# Altium project NXP_FRDM_IMX93.PrjPcb (part 3 of 13)

## Sheet E-07 CPU MISC.SchDoc: FRDM-IMX93
size 513 x 386 mm; DrawnBy: FORLINX; Organization: ORGANIZATION; Address1: ADDRESS 1; Address2: ADDRESS 2; Address3: ADDRESS 3; Address4: ADDRESS 4; Revision: -; ENG_APP_DATE: --/--/--; DSN_APP_DATE: --/--/--; CHK_APP_DATE: --/--/--; Classification: Public, Company Internal/Proprietary, Company Confidential,  Company Secret; Page Create Date: March  8, 1995; OrgName: NXP Semiconductor; FIUO: A; OrgAddr1: NO. 192 Liangjing Rd. Pudong New Area, ShangHai; Page Number: 7; PageTitle: CPU MISC; Page Size: C; Page Count: 23; Designer: FORLINX; RevCode: B1; Approver: NXP SE; Doc: SCH-94611 PDF: SPF-94611; DsnPath: T:\FILES\Designs\Single Board Computers\i.MX93-FRDM\Design Files\SCH-94611_B1.DSN; SchematicName: FRDM-i.MX 93 Development Board; PageName: E-07 CPU MISC; PageSize: C; TopSchematic: True
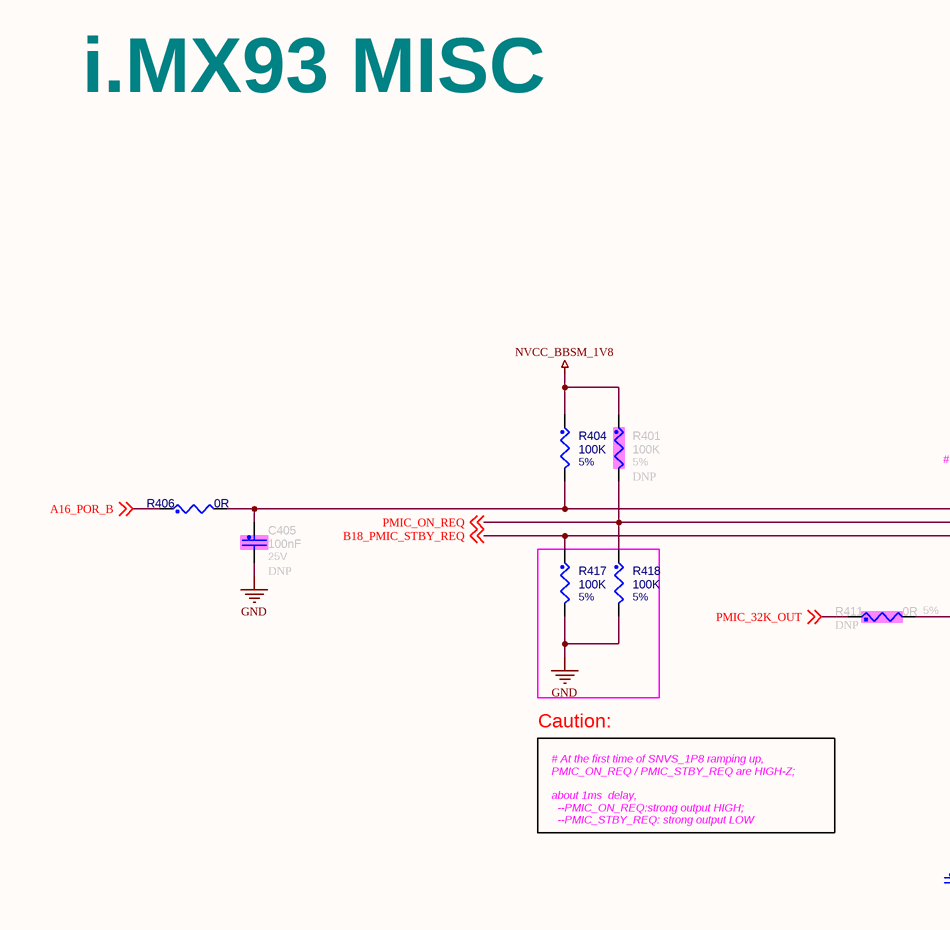
[diagram p13: E-07 CPU MISC.SchDoc, left]
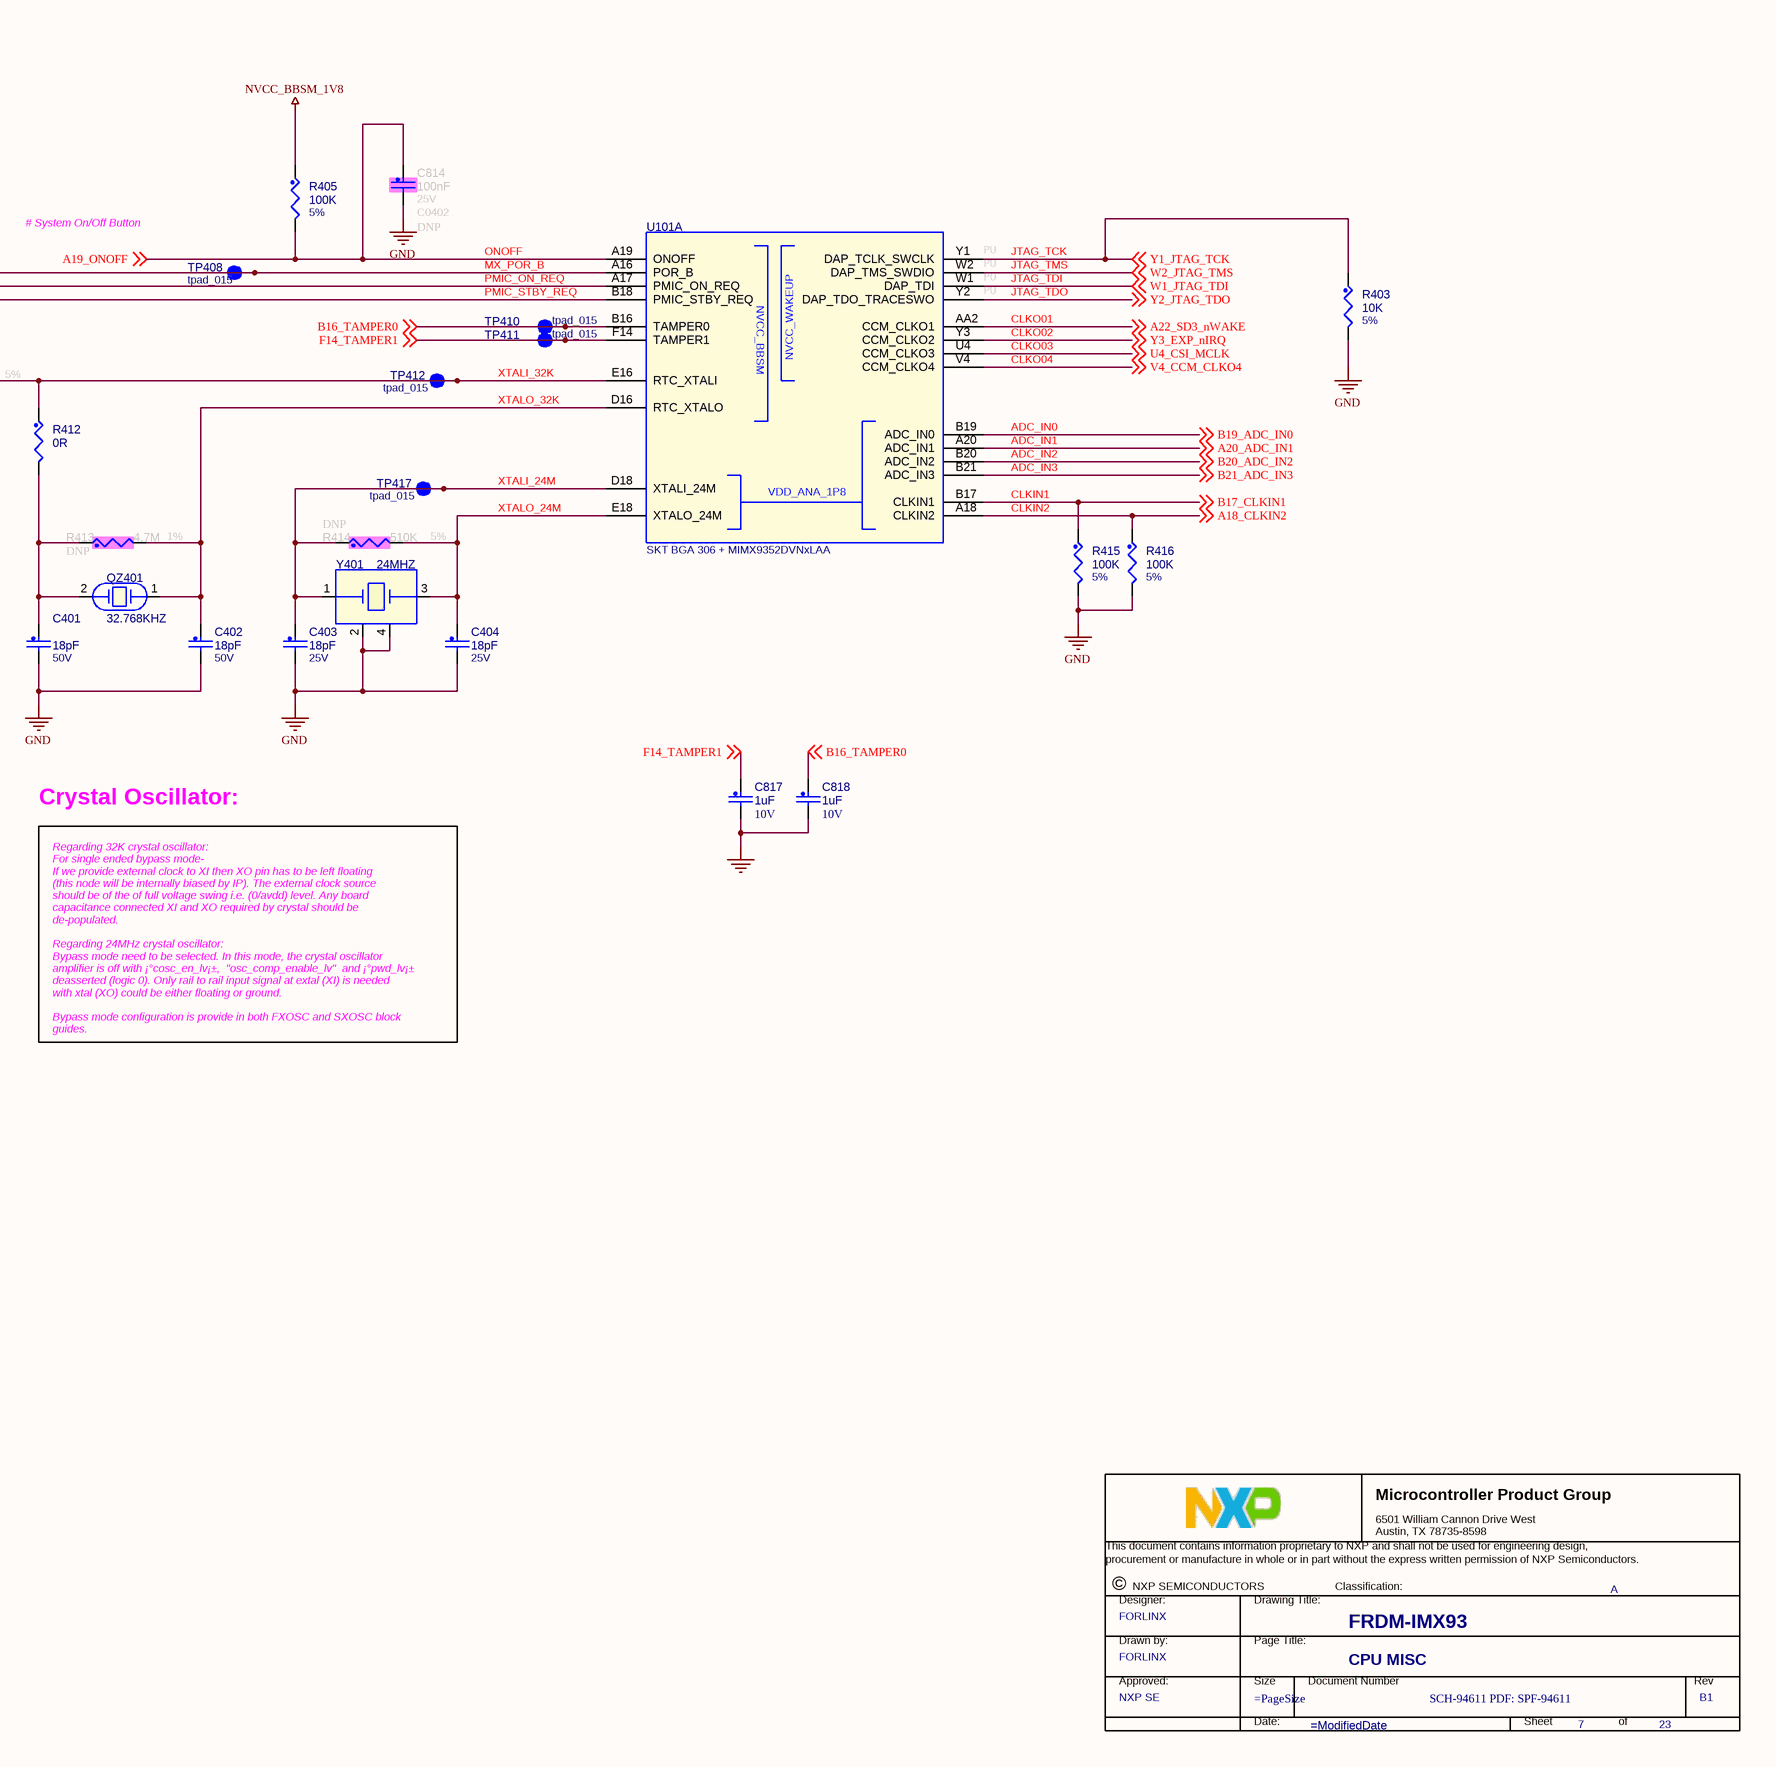
[diagram p14: E-07 CPU MISC.SchDoc, right]

### Parts
(Parts that share a designator on the sheet are numbered #1, #2 ... from top to bottom, then left to right.)
*#7  Title: FRDM-IMX93  RevCode: B1  PageTitle: CPU MISC  Page Number: 7  Page Count: 23  DrawnBy: FORLINX  Doc: SCH-94611 PDF: SPF-94611  Approver: NXP SE  FIUO: A  (graphical)
C401  18pF  VOLTAGE: 50V  [C0201]
C402  18pF  VOLTAGE: 50V  [C0201]
C403  18pF  VOLTAGE: 25V  [C0201]
C404  18pF  VOLTAGE: 25V  [C0201]
C405  100nF  ASSY_OPT: DNP  VOLTAGE: 25V  [C0402]
C814  100nF  ASSY_OPT: DNP  VOLTAGE: 25V  [C0402]
C817  1uF  VOLTAGE: 10V  [C0201]
C818  1uF  VOLTAGE: 10V  [C0201]
QZ401  32.768KHZ  [XTAL2-3P2X1P5-SM]
R401  100K  ASSY_OPT: DNP  Tolerance: 5%  [R0402]
R403  10K  Tolerance: 5%  [R0402]
R404  100K  Tolerance: 5%  [R0402]
R405  100K  Tolerance: 5%  [R0402]
R406  0R  [R0201]
R411  0R  ASSY_OPT: DNP  Tolerance: 5%  [R0201]
R412  0R  [R0201]
R413  4.7M  ASSY_OPT: DNP  Tolerance: 1%  [R0402]
R414  510K  ASSY_OPT: DNP  Tolerance: 5%  [R0402]
R415  100K  Tolerance: 5%  [R0402]
R416  100K  Tolerance: 5%  [R0402]
R417  100K  Tolerance: 5%  [R0402]
R418  100K  Tolerance: 5%  [R0402]
TP408  TPAD_015  [tpad_015]
TP410  TPAD_015  [tpad_015]
TP411  TPAD_015  [tpad_015]
TP412  TPAD_015  [tpad_015]
TP417  TPAD_015  [tpad_015]
U101  SKT BGA 306 + MIMX9352DVNxLAA  [skt_bga306_0p5_sq16p23_elast_nsp]  (part A of 6)
Y401  24MHZ  [xtlosc4_3p2x2p5mm_sm]

### Nets
GND: C401.2 C402.2 C403.2 C404.2 C405.2 C814.2 C817.2 C818.2 R403.2 R415.2 R416.2 R417.2 R418.2 Y401.2 Y401.4
NVCC_BBSM_1V8: R401.1 R404.1 R405.1
A16_POR_B: R406.1 ; off-sheet A16_POR_B
ADC_IN0: U101.B19(ADC_IN0) ; off-sheet B19_ADC_IN0  [also labelled B19_ADC_IN0]
ADC_IN1: U101.A20(ADC_IN1) ; off-sheet A20_ADC_IN1  [also labelled A20_ADC_IN1]
ADC_IN2: U101.B20(ADC_IN2) ; off-sheet B20_ADC_IN2  [also labelled B20_ADC_IN2]
ADC_IN3: U101.B21(ADC_IN3) ; off-sheet B21_ADC_IN3  [also labelled B21_ADC_IN3]
B16_TAMPER0: C818.1 TP410.1(Pin1) U101.B16(TAMPER0) ; off-sheet B16_TAMPER0
CLKIN1: R415.1 U101.B17(CLKIN1) ; off-sheet B17_CLKIN1  [also labelled B17_CLKIN1]
CLKIN2: R416.1 U101.A18(CLKIN2) ; off-sheet A18_CLKIN2  [also labelled A18_CLKIN2]
CLKO01: U101.AA2(CCM_CLKO1) ; off-sheet A22_SD3_nWAKE  [also labelled A22_SD3_nWAKE]
CLKO02: U101.Y3(CCM_CLKO2) ; off-sheet Y3_EXP_nIRQ  [also labelled Y3_EXP_nIRQ]
CLKO03: U101.U4(CCM_CLKO3) ; off-sheet U4_CSI_MCLK  [also labelled U4_CSI_MCLK]
CLKO04: U101.V4(CCM_CLKO4) ; off-sheet V4_CCM_CLKO4  [also labelled V4_CCM_CLKO4]
F14_TAMPER1: C817.1 TP411.1(Pin1) U101.F14(TAMPER1) ; off-sheet F14_TAMPER1
JTAG_TCK: R403.1 U101.Y1(DAP_TCLK_SWCLK) ; off-sheet Y1_JTAG_TCK  [also labelled Y1_JTAG_TCK]
JTAG_TDI: U101.W1(DAP_TDI) ; off-sheet W1_JTAG_TDI  [also labelled W1_JTAG_TDI]
JTAG_TDO: U101.Y2(DAP_TDO_TRACESWO) ; off-sheet Y2_JTAG_TDO  [also labelled Y2_JTAG_TDO]
JTAG_TMS: U101.W2(DAP_TMS_SWDIO) ; off-sheet W2_JTAG_TMS  [also labelled W2_JTAG_TMS]
MX_POR_B: C405.1 R404.2 R406.2 TP408.1(Pin1) U101.A16(POR_B)
ONOFF: C814.1 R405.2 U101.A19(ONOFF) ; off-sheet A19_ONOFF  [also labelled A19_ONOFF]
PMIC_32K_OUT: R411.1 ; off-sheet PMIC_32K_OUT
PMIC_ON_REQ: R401.2 R418.1 U101.A17(PMIC_ON_REQ) ; off-sheet PMIC_ON_REQ
PMIC_STBY_REQ: R417.1 U101.B18(PMIC_STBY_REQ) ; off-sheet B18_PMIC_STBY_REQ  [also labelled B18_PMIC_STBY_REQ]
XTALI_24M: C403.1 R414.1 TP417.1(Pin1) U101.D18(XTALI_24M) Y401.1
XTALI_32K: R411.2 R412.1 TP412.1(Pin1) U101.E16(RTC_XTALI)
XTALO_24M: C404.1 R414.2 U101.E18(XTALO_24M) Y401.3
XTALO_32K: C402.1 QZ401.1 R413.2 U101.D16(RTC_XTALO)
NetC401_1: C401.1 QZ401.2 R412.2 R413.1

### Notes on the sheet
- i.MX93 MISC
- # System On/Off Button
- (near U101) PU
- Caution:
- # At the first time of SNVS_1P8 ramping up,
  PMIC_ON_REQ / PMIC_STBY_REQ are HIGH-Z;
  about 1ms  delay,
  --PMIC_ON_REQ:strong output HIGH;
  --PMIC_STBY_REQ: strong output LOW
- Crystal Oscillator:
- Regarding 32K crystal oscillator:
  For single ended bypass mode-
  If we provide external clock to XI then XO pin has to be left floating
  (this node will be internally biased by IP). The external clock source
  should be of the of full voltage swing i.e. (0/avdd) level. Any board
  capacitance connected XI and XO required by crystal should be
  de-populated.
  Regarding 24MHz crystal oscillator:
  Bypass mode need to be selected. In this mode, the crystal oscillator
  amplifier is off with ¡°cosc_en_lv¡±,  "osc_comp_enable_lv"  and ¡°pwd_lv¡±
  deasserted (logic 0). Only rail to rail input signal at extal (XI) is needed
  with xtal (XO) could be either floating or ground.
  Bypass mode configuration is provide in both FXOSC and SXOSC block
  guides.
- DWG. NO.
- REV.
- SHT.
- REVISION
- DESCRIPTION
- DATE
- APPROVED
- ENG:
- APPROVALS
- quilter.ai <http://quilter.ai>
- DSN:
- CHK:
- REFERENCE DOCUMENTS
- TITLE
- PROJECT
- BOM:
- FAB DWG:
- PCB DWG:
- ASSY DWG:
- SIZE
- FILE NAME
- C
- DWG NO.
- SHEET
- OF
- REV
- (in symbol MIMX9352DVNxLAA, part A) NVCC_BBSM; NVCC_WAKEUP; VDD_ANA_1P8
- (in symbol TitleBlock_MCPG) Microcontroller Product Group; 6501 William Cannon Drive West / Austin, TX 78735-8598; This document contains information proprietary to NXP and shall not be used for engineering design,; procurement or manufacture in whole or in part without the express written permission of NXP Semiconductors.; ©; NXP SEMICONDUCTORS; Classification:; Designer:; Drawing Title:; Drawn by:; Page Title:; Approved:; Size; Document Number; Rev; Date:; Sheet; of

### Library data of the parts
*#7 = TitleBlock_MCPG: Classification: Public, Company Internal/Proprietary, Company Confidential,  Company Secret; OrgAddr1: NO. 192 Liangjing Rd. Pudong New Area, ShangHai; OrgName: NXP Semiconductor; Page Size: =PageSize; Page Create Date: March  8, 1995; Designer: FORLINX; Page Modify Date: =ModifiedDate
C401 = CAP_NP: 0201,18pF,50V,+/-5%,NPO; Part Reference: C401; CLASS: DISCRETE; Tolerance: 5%; MFG_NAME01: FENGHUA; MFG_PN01: 0201CG180J500NT; CAD_APPROVED: Yes; FPLIST: CC0201,CC0201_HD,0201_CC; Value: 18pF; ROHS: Yes; HEIGHT: 0.33MM; Package Size: 0201; Package Type: &#966;180mm Paper taping; PCB Footprint: C0201
C402 = CAP_NP: 0201,18pF,50V,+/-5%,NPO; Part Reference: C402; CLASS: DISCRETE; FPLIST: CC0201,CC0201_HD,0201_CC; CAD_APPROVED: Yes; MFG_PN01: 0201CG180J500NT; MFG_NAME01: FENGHUA; Tolerance: 5%; Value: 18pF; HEIGHT: 0.33MM; ROHS: Yes; Package Size: 0201; Package Type: &#966;180mm Paper taping; PCB Footprint: C0201
C403 = CAP_NP: 0201,18pF,50V,+/-5%,NPO; Part Reference: C403; CLASS: DISCRETE; Tolerance: 5%; MFG_NAME01: FENGHUA; MFG_PN01: 0201CG180J500NT; CAD_APPROVED: Yes; FPLIST: CC0201,CC0201_HD,0201_CC; Value: 18pF; ROHS: Yes; HEIGHT: 0.33MM; PCB Footprint: C0201
C404 = CAP_NP: 0201,18pF,50V,+/-5%,NPO; Part Reference: C404; CLASS: DISCRETE; Tolerance: 5%; MFG_NAME01: FENGHUA; MFG_PN01: 0201CG180J500NT; CAD_APPROVED: Yes; FPLIST: CC0201,CC0201_HD,0201_CC; Value: 18pF; ROHS: Yes; HEIGHT: 0.33MM; PCB Footprint: C0201
C405 = CAP_NP: 0402,100nF,50V,+/-10%,X5R; Part Reference: C405; CLASS: DISCRETE; FPLIST: CC0402_25,CC0402_HD,0402_CC; CAD_APPROVED: Yes; MFG_PN01: 0402X104K500NT; MFG_NAME01: FENGHUA; Tolerance: 10%; Value: 100nF; HEIGHT: 0.55MM; ROHS: Yes; Package Size: 0402; PCB Footprint: C0402
C814 = CAP_NP: 0402,100nF,50V,+/-10%,X5R; Part Reference: C814; CLASS: DISCRETE; Tolerance: 10%; MFG_NAME01: FENGHUA; MFG_PN01: 0402X104K500NT; CAD_APPROVED: Yes; FPLIST: CC0402_25,CC0402_HD,0402_CC; Value: 100nF; Package Size: 0402; ROHS: Yes; HEIGHT: 0.55MM; PCB Footprint: C0402
C817 = CAP_NP: 0201,1uF,10V,+/-20%,X5R; Part Reference: C817; CLASS: DISCRETE; FPLIST: CC0201,CC0201_HD,0201_CC,cc_0201_cir; CAD_APPROVED: Yes; MFG_PN01: CL03A105MP3NSNC; MFG_NAME01: SAMSUNG; Tolerance: 10%; Temp Range: -55¡ãC to 85¡ãC; Value: 1uF; Package Type: SMD/SMT; Package Size: 0201 (0603 Metric); HEIGHT: 0.35MM; ROHS: Yes; PCB Footprint: C0201
C818 = CAP_NP: 0201,1uF,10V,+/-20%,X5R; Part Reference: C818; CLASS: DISCRETE; FPLIST: CC0201,CC0201_HD,0201_CC,cc_0201_cir; CAD_APPROVED: Yes; MFG_PN01: CL03A105MP3NSNC; MFG_NAME01: SAMSUNG; Tolerance: 10%; Temp Range: -55¡ãC to 85¡ãC; Value: 1uF; Package Type: SMD/SMT; Package Size: 0201 (0603 Metric); HEIGHT: 0.35MM; ROHS: Yes; PCB Footprint: C0201
QZ401 = XTAL: Crystal,32.768KHZ,3.2*1.5mm,+/-20ppm,12.5PF,S999-311,-40~85+C; Part Reference: QZ401; CLASS: IC; MFG_NAME01: Dongxin Hengke; MFG_PN01: KK32768g33C; CAD_APPROVED: Yes; Value: 32.768KHZ; ROHS: Yes; HEIGHT: 0.9MM; PCB Footprint: XTAL2-3P2X1P5-SM
R401 = RES: 0402,100K,+/-1%; Part Reference: R401; CLASS: DISCRETE; Temp Range: -55C to +155C; VOLTAGE: 50V; MFG_NAME01: FENGHUA; MFG_PN01: RC-02K1003FT; CAD_APPROVED: Yes; FPLIST: RC0402_25,RC0402_HD,0402_CC; Value: 100K; ROHS: Yes; HEIGHT: 0.40 MM; PCB Footprint: R0402
R403 = RES: 0402,10K,+/-1%; Part Reference: R403; CLASS: DISCRETE; MFG_NAME01: FENGHUA; MFG_PN01: RC-02W1002FT; CAD_APPROVED: Yes; FPLIST: RC0402_25,RC0402_HD,0402_CC; Value: 10K; ROHS: Yes; HEIGHT: 0.4 MM; PCB Footprint: R0402
R404 = RES: 0402,100K,+/-1%; Part Reference: R404; CLASS: DISCRETE; Temp Range: -55C to +155C; VOLTAGE: 50V; MFG_NAME01: FENGHUA; MFG_PN01: RC-02K1003FT; CAD_APPROVED: Yes; FPLIST: RC0402_25,RC0402_HD,0402_CC; Value: 100K; ROHS: Yes; HEIGHT: 0.40 MM; PCB Footprint: R0402
R405 = RES: 0402,100K,+/-1%; Part Reference: R405; CLASS: DISCRETE; FPLIST: RC0402_25,RC0402_HD,0402_CC; CAD_APPROVED: Yes; MFG_PN01: RC-02K1003FT; MFG_NAME01: FENGHUA; VOLTAGE: 50V; Temp Range: -55C to +155C; Value: 100K; HEIGHT: 0.40 MM; ROHS: Yes; PCB Footprint: R0402
R406 = RES: 0201,0Ohm,+/-5%; Part Reference: R406; CLASS: DISCRETE; FPLIST: RC0201,0201_CC,RC0201_X2; CAD_APPROVED: Yes; MFG_PN01: RC-01000JT; MFG_NAME01: FENGHUA; Value: 0R; HEIGHT: 0.30 MM; ROHS: Yes; PCB Footprint: R0201
R411 = RES: 0201,0Ohm,+/-5%; Part Reference: R411; CLASS: DISCRETE; FPLIST: RC0201,0201_CC,RC0201_X2; CAD_APPROVED: Yes; MFG_PN01: RC-01000JT; MFG_NAME01: FENGHUA; Value: 0R; HEIGHT: 0.30 MM; ROHS: Yes; PCB Footprint: R0201
R412 = RES: 0201,0Ohm,+/-5%; Part Reference: R412; CLASS: DISCRETE; FPLIST: RC0201,0201_CC,RC0201_X2; CAD_APPROVED: Yes; MFG_PN01: RC-01000JT; MFG_NAME01: FENGHUA; Value: 0R; HEIGHT: 0.30 MM; ROHS: Yes; PCB Footprint: R0201
R413 = RES: 0402,4.7M,+/-5%; Part Reference: R413; CLASS: DISCRETE; FPLIST: RC0402_25,RC0402_HD,0402_CC; CAD_APPROVED: Yes; VOLTAGE: 50V; Temp Range: -55¡ãC ~ 155¡ãC; MFG_NAME01: FENGHUA; MFG_PN01: RC-02U475JT; Value: 4.7M; HEIGHT: 0.40 MM; ROHS: Yes; PCB Footprint: R0402
R414 = RES: 0402,510K,+/-5%; Part Reference: R414; CLASS: DISCRETE; MFG_NAME01: FENGHUA; MFG_PN01: RC-02K514JT; CAD_APPROVED: Yes; FPLIST: RC0402_25,RC0402_HD,0402_CC; Value: 510K; ROHS: Yes; HEIGHT: 0.4 MM; PCB Footprint: R0402
R415 = RES: 0402,100K,+/-1%; Part Reference: R415; CLASS: DISCRETE; FPLIST: RC0402_25,RC0402_HD,0402_CC; CAD_APPROVED: Yes; MFG_PN01: RC-02K1003FT; MFG_NAME01: FENGHUA; VOLTAGE: 50V; Temp Range: -55C to +155C; Value: 100K; HEIGHT: 0.40 MM; ROHS: Yes; PCB Footprint: R0402
R416 = RES: 0402,100K,+/-1%; Part Reference: R416; CLASS: DISCRETE; FPLIST: RC0402_25,RC0402_HD,0402_CC; CAD_APPROVED: Yes; MFG_PN01: RC-02K1003FT; MFG_NAME01: FENGHUA; VOLTAGE: 50V; Temp Range: -55C to +155C; Value: 100K; HEIGHT: 0.40 MM; ROHS: Yes; PCB Footprint: R0402
R417 = RES: 0402,100K,+/-1%; Part Reference: R417; CLASS: DISCRETE; FPLIST: RC0402_25,RC0402_HD,0402_CC; CAD_APPROVED: Yes; MFG_PN01: RC-02K1003FT; MFG_NAME01: FENGHUA; VOLTAGE: 50V; Temp Range: -55C to +155C; Value: 100K; HEIGHT: 0.40 MM; ROHS: Yes; PCB Footprint: R0402
R418 = RES: 0402,100K,+/-1%; Part Reference: R418; CLASS: DISCRETE; FPLIST: RC0402_25,RC0402_HD,0402_CC; CAD_APPROVED: Yes; MFG_PN01: RC-02K1003FT; MFG_NAME01: FENGHUA; VOLTAGE: 50V; Temp Range: -55C to +155C; Value: 100K; HEIGHT: 0.40 MM; ROHS: Yes; PCB Footprint: R0402
TP408 = TESTLOOP: no part to order; Part Reference: TP408; CLASS: IO; ASSY_OPT: DNP; CAD_APPROVED: Yes; MFG_PN01: NOT A COMPONENT; HEIGHT: 0.1MM; ROHS: Yes; MFG_NAME01: NOT A COMPONENT; PCB Footprint: tpad_015
TP410 = TESTLOOP: no part to order; Part Reference: TP410; CLASS: IO; ASSY_OPT: DNP; MFG_NAME01: NOT A COMPONENT; CAD_APPROVED: Yes; MFG_PN01: NOT A COMPONENT; ROHS: Yes; HEIGHT: 0.1MM; PCB Footprint: tpad_015
TP411 = TESTLOOP: no part to order; Part Reference: TP411; CLASS: IO; ASSY_OPT: DNP; CAD_APPROVED: Yes; MFG_PN01: NOT A COMPONENT; HEIGHT: 0.1MM; ROHS: Yes; MFG_NAME01: NOT A COMPONENT; PCB Footprint: tpad_015
TP412 = TESTLOOP: no part to order; Part Reference: TP412; CLASS: IO; ASSY_OPT: DNP; CAD_APPROVED: Yes; MFG_PN01: NOT A COMPONENT; HEIGHT: 0.1MM; ROHS: Yes; MFG_NAME01: NOT A COMPONENT; PCB Footprint: tpad_015
TP417 = TESTLOOP: no part to order; Part Reference: TP417; CLASS: IO; ASSY_OPT: DNP; MFG_NAME01: NOT A COMPONENT; CAD_APPROVED: Yes; MFG_PN01: NOT A COMPONENT; ROHS: Yes; HEIGHT: 0.1MM; PCB Footprint: tpad_015
U101 = MIMX9352DVNxLAA: MIMX9352CVVXMAB,-40~105+C,11*11mm,0.5mm pitch,FCBGA,A,306pin,1.7GHz; Part Reference: U101; CLASS: IC; MFG_NAME01: NXP SEMICONDUCTORS; CAD_APPROVED: Yes; FPLIST: skt_bga306_0p5_sq16p23_elast,skt_bga306_0p5_sq16p23_elast_nsp; Value: SKT BGA 306 + MIMX9352DVNxLAA; MFG_PN01: MIMX9352DVNxLAA; ROHS: Yes; HEIGHT: 10.03MM; PCB Footprint: skt_bga306_0p5_sq16p23_elast_nsp
Y401 = XTAL_13: Crystal,24MHZ,4P,3.2*2.5mm,+/-20ppm,12pF; Part Reference: Y401; CLASS: IC; MFG_NAME01: Dongxin Hengke; MFG_PN01: SE24000G33D; CAD_APPROVED: Yes; Value: 24MHZ; ROHS: Yes; HEIGHT: 0.60MM; PCB Footprint: xtlosc4_3p2x2p5mm_sm

## Sheet E-08 eMMC.SchDoc: FRDM-IMX93
size 513 x 386 mm; DrawnBy: FORLINX; Organization: ORGANIZATION; Address1: ADDRESS 1; Address2: ADDRESS 2; Address3: ADDRESS 3; Address4: ADDRESS 4; Revision: -; ENG_APP_DATE: --/--/--; DSN_APP_DATE: --/--/--; CHK_APP_DATE: --/--/--; Classification: Public, Company Internal/Proprietary, Company Confidential,  Company Secret; Page Create Date: March  8, 1995; OrgName: NXP Semiconductor; FIUO: A; OrgAddr1: NO. 192 Liangjing Rd. Pudong New Area, ShangHai; Page Number: 8; PageTitle: eMMC; Page Size: C; Comment: TitleBlock_MCPG; Page Count: 23; Designer: FORLINX; RevCode: B1; Approver: NXP SE; Doc: SCH-94611 PDF: SPF-94611; DsnPath: T:\FILES\Designs\Single Board Computers\i.MX93-FRDM\Design Files\SCH-94611_B1.DSN; SchematicName: FRDM-i.MX 93 Development Board; PageName: E-08 eMMC; PageSize: C; TopSchematic: True
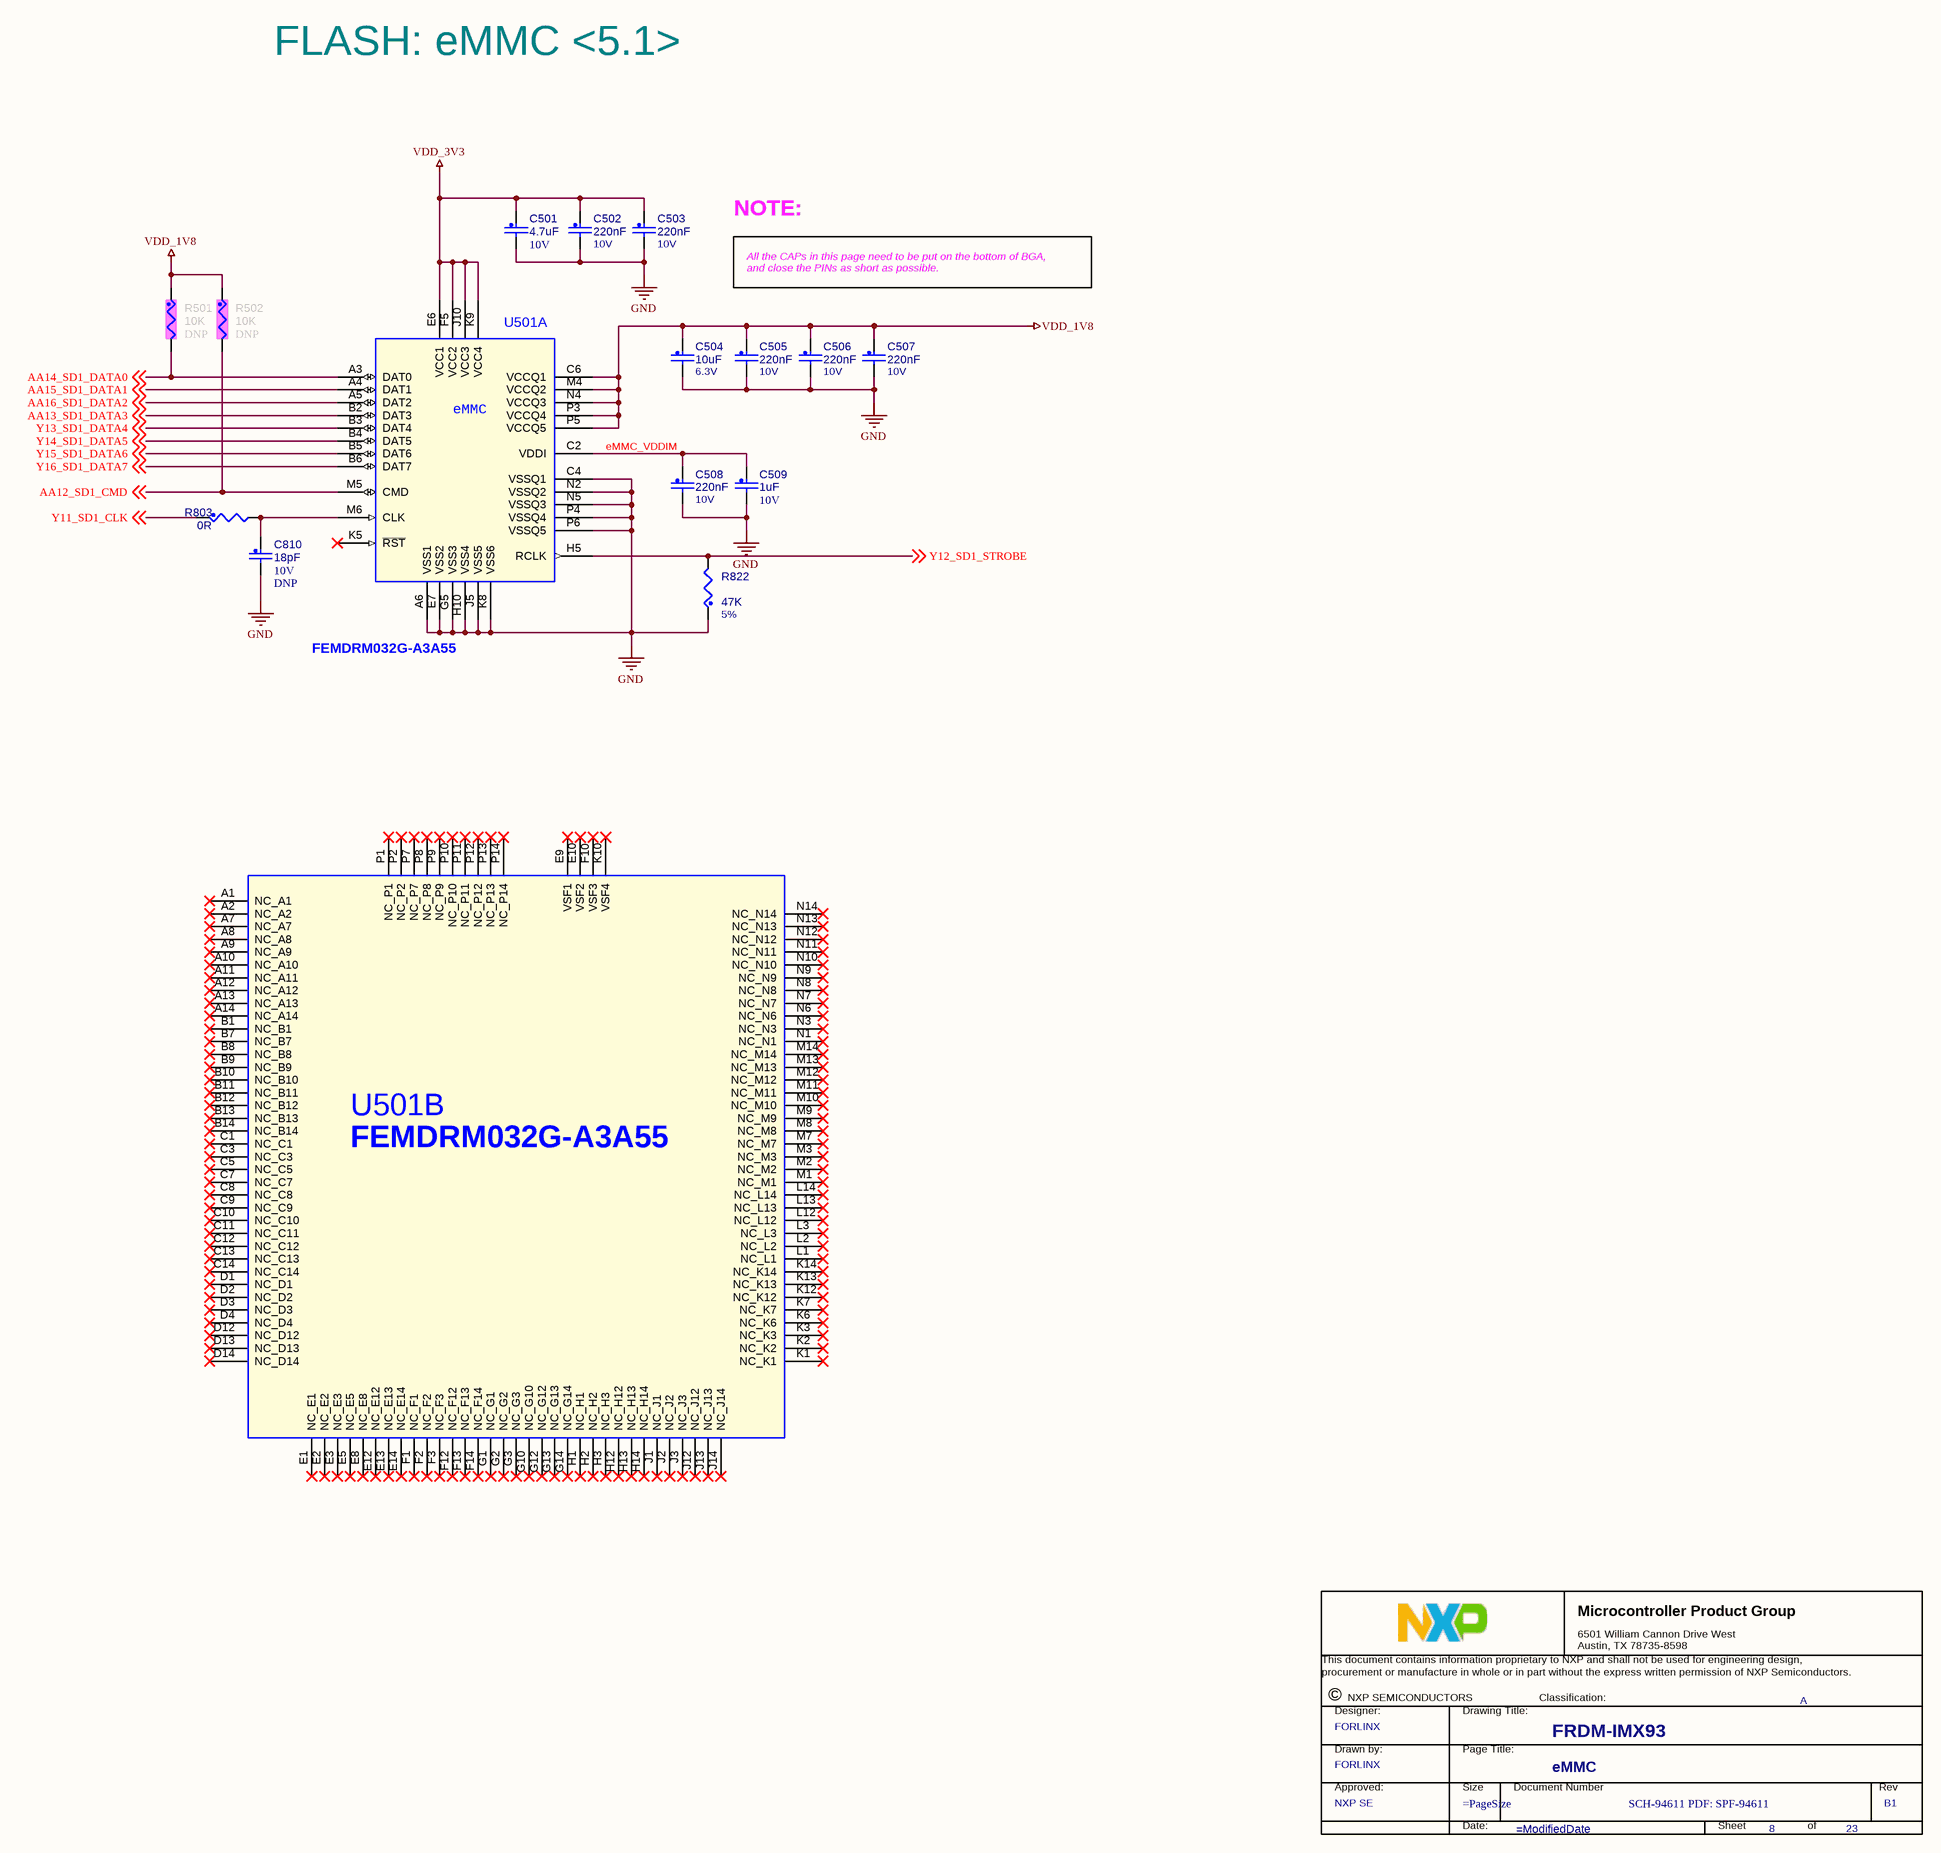
[diagram p15: E-08 eMMC.SchDoc]

### Parts
(Parts that share a designator on the sheet are numbered #1, #2 ... from top to bottom, then left to right.)
*#8  Title: FRDM-IMX93  RevCode: B1  PageTitle: eMMC  Page Number: 8  Page Count: 23  DrawnBy: FORLINX  Doc: SCH-94611 PDF: SPF-94611  Approver: NXP SE  FIUO: A  (hidden comment: TitleBlock_MCPG)  (graphical)
C501  4.7uF  VOLTAGE: 10V  [C0402]
C502  220nF  VOLTAGE: 10V  [C0201]
C503  220nF  VOLTAGE: 10V  [C0201]
C504  10uF  VOLTAGE: 6.3V  [C0402]
C505  220nF  VOLTAGE: 10V  [C0201]
C506  220nF  VOLTAGE: 10V  [C0201]
C507  220nF  VOLTAGE: 10V  [C0201]
C508  220nF  VOLTAGE: 10V  [C0201]
C509  1uF  VOLTAGE: 10V  [C0201]
C810  18pF  ASSY_OPT: DNP  VOLTAGE: 10V  [C0201]
R501  10K  ASSY_OPT: DNP  [R0201]
R502  10K  ASSY_OPT: DNP  [R0201]
R803  0R  [R0201]
R822  47K  Tolerance: 5%  [R0201]
U501  FEMDRM032G-A3A55  [fbga153_0p5_11p5x13]  (parts A,B of 2)

### Nets
GND: C501.2 C502.2 C503.2 C504.2 C505.2 C506.2 C507.2 C508.2 C509.2 C810.2 R822.1 U501.A6(VSS1) U501.C4(VSSQ1) U501.E7(VSS2) U501.G5(VSS3) U501.H10(VSS4) U501.J5(VSS5) U501.K8(VSS6) U501.N2(VSSQ2) U501.N5(VSSQ3) U501.P4(VSSQ4) U501.P6(VSSQ5)
VDD_1V8: C504.1 C505.1 C506.1 C507.1 R501.1 R502.1 U501.C6(VCCQ1) U501.M4(VCCQ2) U501.N4(VCCQ3) U501.P3(VCCQ4) U501.P5(VCCQ5)  [project net LPD4/x_VDD1]
VDD_3V3: C501.1 C502.1 C503.1 U501.E6(VCC1) U501.F5(VCC2) U501.J10(VCC3) U501.K9(VCC4)
AA12_SD1_CMD: R502.2 U501.M5(CMD) ; off-sheet AA12_SD1_CMD  [project net SD1_CMD]
AA13_SD1_DATA3: U501.B2(DAT3) ; off-sheet AA13_SD1_DATA3  [project net SD1_DATA3]
AA14_SD1_DATA0: R501.2 U501.A3(DAT0) ; off-sheet AA14_SD1_DATA0  [project net SD1_DATA0]
AA15_SD1_DATA1: U501.A4(DAT1) ; off-sheet AA15_SD1_DATA1  [project net SD1_DATA1]
AA16_SD1_DATA2: U501.A5(DAT2) ; off-sheet AA16_SD1_DATA2  [project net SD1_DATA2]
eMMC_VDDIM: C508.1 C509.1 U501.C2(VDDI)
Y11_SD1_CLK: R803.1 ; off-sheet Y11_SD1_CLK  [project net SD1_CLK]
Y12_SD1_STROBE: R822.2 U501.H5(RCLK) ; off-sheet Y12_SD1_STROBE  [project net SD1_STROBE]
Y13_SD1_DATA4: U501.B3(DAT4) ; off-sheet Y13_SD1_DATA4  [project net SD1_DATA4]
Y14_SD1_DATA5: U501.B4(DAT5) ; off-sheet Y14_SD1_DATA5  [project net SD1_DATA5]
Y15_SD1_DATA6: U501.B5(DAT6) ; off-sheet Y15_SD1_DATA6  [project net SD1_DATA6]
Y16_SD1_DATA7: U501.B6(DAT7) ; off-sheet Y16_SD1_DATA7  [project net SD1_DATA7]
NetC810_1: C810.1 R803.2 U501.M6(CLK)

Not connected (* = marked no-connect by the designer): U501 A1(NC_A1)* A2(NC_A2)* A7(NC_A7)* A8(NC_A8)* A9(NC_A9)* A10(NC_A10)* A11(NC_A11)* A12(NC_A12)* A13(NC_A13)* A14(NC_A14)* B1(NC_B1)* B7(NC_B7)* B8(NC_B8)* B9(NC_B9)* B10(NC_B10)* B11(NC_B11)* B12(NC_B12)* B13(NC_B13)* B14(NC_B14)* C1(NC_C1)* C3(NC_C3)* C5(NC_C5)* C7(NC_C7)* C8(NC_C8)* C9(NC_C9)* C10(NC_C10)* C11(NC_C11)* C12(NC_C12)* C13(NC_C13)* C14(NC_C14)* D1(NC_D1)* D2(NC_D2)* D3(NC_D3)* D4(NC_D4)* D12(NC_D12)* D13(NC_D13)* D14(NC_D14)* E1(NC_E1)* E2(NC_E2)* E3(NC_E3)* E5(NC_E5)* E8(NC_E8)* E9(VSF1)* E10(VSF2)* E12(NC_E12)* E13(NC_E13)* E14(NC_E14)* F1(NC_F1)* F2(NC_F2)* F3(NC_F3)* F10(VSF3)* F12(NC_F12)* F13(NC_F13)* F14(NC_F14)* G1(NC_G1)* G2(NC_G2)* G3(NC_G3)* G10(NC_G10)* G12(NC_G12)* G13(NC_G13)* G14(NC_G14)* H1(NC_H1)* H2(NC_H2)* H3(NC_H3)* H12(NC_H12)* H13(NC_H13)* H14(NC_H14)* J1(NC_J1)* J2(NC_J2)* J3(NC_J3)* J12(NC_J12)* J13(NC_J13)* J14(NC_J14)* K1(NC_K1)* K2(NC_K2)* K3(NC_K3)* K5(~{RST})* K6(NC_K6)* K7(NC_K7)* K10(VSF4)* K12(NC_K12)* K13(NC_K13)* K14(NC_K14)* L1(NC_L1)* L2(NC_L2)* L3(NC_L3)* L12(NC_L12)* L13(NC_L13)* L14(NC_L14)* M1(NC_M1)* M2(NC_M2)* M3(NC_M3)* M7(NC_M7)* M8(NC_M8)* M9(NC_M9)* M10(NC_M10)* M11(NC_M11)* M12(NC_M12)* M13(NC_M13)* M14(NC_M14)* N1(NC_N1)* N3(NC_N3)* N6(NC_N6)* N7(NC_N7)* N8(NC_N8)* N9(NC_N9)* N10(NC_N10)* N11(NC_N11)* N12(NC_N12)* N13(NC_N13)* N14(NC_N14)* P1(NC_P1)* P2(NC_P2)* P7(NC_P7)* P8(NC_P8)* P9(NC_P9)* P10(NC_P10)* P11(NC_P11)* P12(NC_P12)* P13(NC_P13)* P14(NC_P14)*

### Notes on the sheet
- FLASH: eMMC <5.1>
- NOTE:
- All the CAPs in this page need to be put on the bottom of BGA,
  and close the PINs as short as possible.
- DWG. NO.
- REV.
- SHT.
- REVISION
- DESCRIPTION
- DATE
- APPROVED
- ENG:
- APPROVALS
- quilter.ai <http://quilter.ai>
- DSN:
- CHK:
- REFERENCE DOCUMENTS
- TITLE
- PROJECT
- BOM:
- FAB DWG:
- PCB DWG:
- ASSY DWG:
- SIZE
- FILE NAME
- C
- DWG NO.
- SHEET
- OF
- REV
- (in symbol SDINBDA6_32G_I_VFBGA_153P, part A) eMMC
- (in symbol TitleBlock_MCPG) Microcontroller Product Group; 6501 William Cannon Drive West / Austin, TX 78735-8598; This document contains information proprietary to NXP and shall not be used for engineering design,; procurement or manufacture in whole or in part without the express written permission of NXP Semiconductors.; ©; NXP SEMICONDUCTORS; Classification:; Designer:; Drawing Title:; Drawn by:; Page Title:; Approved:; Size; Document Number; Rev; Date:; Sheet; of

### Library data of the parts
*#8 = TitleBlock_MCPG: Classification: Public, Company Internal/Proprietary, Company Confidential,  Company Secret; OrgName: NXP Semiconductor; OrgAddr1: NO. 192 Liangjing Rd. Pudong New Area, ShangHai; Page Size: =PageSize; Page Create Date: March  8, 1995; Designer: FORLINX; Page Modify Date: =ModifiedDate
C501 = CAP_NP: 0402,4.7uF,10V,+/-10%,X5R; Part Reference: C501; CLASS: DISCRETE; FPLIST: cc0402_tol0p15,cc0402_tol0p15_ov,0402_cc_nsp; CAD_APPROVED: Yes; MFG_PN01: CL05A475KP5NRNC; MFG_NAME01: SAMSUNG; Tolerance: 10%; 3D_Mechanical_Footprint_File: cc0402_tol0p15; Value: 4.7uF; PCB Footprint: C0402; HEIGHT: 0.65MM; ROHS: Yes
C502 = CAP_NP: 0201,220nF,6.3V,+/-20%,X5R; Part Reference: C502; CLASS: DISCRETE; Tolerance: 20%; MFG_NAME01: SAMSUNG; MFG_PN01: CL03A224MQ3NNNC; CAD_APPROVED: Yes; FPLIST: CC0201,CC0201_HD,0201_CC; Value: 220nF; PCB Footprint: C0201; ROHS: Yes; HEIGHT: 0.33MM
C503 = CAP_NP: 0201,220nF,6.3V,+/-20%,X5R; Part Reference: C503; CLASS: DISCRETE; FPLIST: CC0201,CC0201_HD,0201_CC; CAD_APPROVED: Yes; MFG_PN01: CL03A224MQ3NNNC; MFG_NAME01: SAMSUNG; Tolerance: 20%; Value: 220nF; PCB Footprint: C0201; HEIGHT: 0.33MM; ROHS: Yes
C504 = CAP_NP: 0402,10uF,6.3V,+/-20%,X5R; Part Reference: C504; CLASS: DISCRETE; FPLIST: CC0402_25,CC0402_HD,0402_CC; CAD_APPROVED: Yes; MFG_PN01: 0402X106M6R3NT; MFG_NAME01: FENGHUA; Tolerance: 20%; Value: 10uF; PCB Footprint: C0402; HEIGHT: 0.65 MM; ROHS: Yes
C505 = CAP_NP: 0201,220nF,6.3V,+/-20%,X5R; Part Reference: C505; CLASS: DISCRETE; FPLIST: CC0201,CC0201_HD,0201_CC; CAD_APPROVED: Yes; MFG_PN01: CL03A224MQ3NNNC; MFG_NAME01: SAMSUNG; Tolerance: 20%; Value: 220nF; PCB Footprint: C0201; HEIGHT: 0.33MM; ROHS: Yes
C506 = CAP_NP: 0201,220nF,6.3V,+/-20%,X5R; Part Reference: C506; CLASS: DISCRETE; FPLIST: CC0201,CC0201_HD,0201_CC; CAD_APPROVED: Yes; MFG_PN01: CL03A224MQ3NNNC; MFG_NAME01: SAMSUNG; Tolerance: 20%; Value: 220nF; PCB Footprint: C0201; HEIGHT: 0.33MM; ROHS: Yes
C507 = CAP_NP: 0201,220nF,6.3V,+/-20%,X5R; Part Reference: C507; CLASS: DISCRETE; Tolerance: 20%; MFG_NAME01: SAMSUNG; MFG_PN01: CL03A224MQ3NNNC; CAD_APPROVED: Yes; FPLIST: CC0201,CC0201_HD,0201_CC; Value: 220nF; PCB Footprint: C0201; ROHS: Yes; HEIGHT: 0.33MM
C508 = CAP_NP: 0201,220nF,6.3V,+/-20%,X5R; Part Reference: C508; CLASS: DISCRETE; Tolerance: 20%; MFG_NAME01: SAMSUNG; MFG_PN01: CL03A224MQ3NNNC; CAD_APPROVED: Yes; FPLIST: CC0201,CC0201_HD,0201_CC; Value: 220nF; PCB Footprint: C0201; ROHS: Yes; HEIGHT: 0.33MM
C509 = CAP_NP: 0201,1uF,10V,+/-20%,X5R; Part Reference: C509; CLASS: DISCRETE; Temp Range: -55¡ãC to 85¡ãC; FPLIST: CC0201,CC0201_HD,0201_CC,cc_0201_cir; CAD_APPROVED: Yes; MFG_PN01: CL03A105MP3NSNC; MFG_NAME01: SAMSUNG; Tolerance: 10%; Value: 1uF; PCB Footprint: C0201; HEIGHT: 0.35MM; ROHS: Yes; Package Size: 0201 (0603 Metric); Package Type: SMD/SMT
C810 = CAP_NP: 0201,18pF,50V,+/-5%,NPO; Part Reference: C810; CLASS: DISCRETE; Temp Range: -55¡ãC to 85¡ãC; FPLIST: CC0201,CC0201_HD,0201_CC,cc_0201_cir; CAD_APPROVED: Yes; MFG_PN01: 0201CG180J500NT; MFG_NAME01: FENGHUA; Tolerance: 10%; Value: 18pF; PCB Footprint: C0201; HEIGHT: 0.35MM; ROHS: Yes; Package Size: 0201 (0603 Metric); Package Type: SMD/SMT
R501 = RES: 0201,10K,+/-5%; Part Reference: R501; CLASS: DISCRETE; Tolerance: 5%; MFG_NAME01: FENGHUA; MFG_PN01: RC-01W103JT; CAD_APPROVED: Yes; FPLIST: RC0402_25,RC0402_HD,0402_CC; Value: 10K; PCB Footprint: R0201; ROHS: Yes; HEIGHT: 0.4 MM
R502 = RES: 0201,10K,+/-5%; Part Reference: R502; CLASS: DISCRETE; FPLIST: RC0402_25,RC0402_HD,0402_CC; CAD_APPROVED: Yes; MFG_PN01: RC-01W103JT; MFG_NAME01: FENGHUA; Tolerance: 5%; Value: 10K; PCB Footprint: R0201; HEIGHT: 0.4 MM; ROHS: Yes
R803 = RES: 0201,0Ohm,+/-5%; Part Reference: R803; CLASS: DISCRETE; FPLIST: RC0402_25,RC0402_HD,0402_CC; CAD_APPROVED: Yes; MFG_PN01: RC-01000JT; MFG_NAME01: FENGHUA; Tolerance: 5%; Value: 0R; PCB Footprint: R0201; HEIGHT: 0.4 MM; ROHS: Yes
R822 = RES: 0201,47K,5%; Part Reference: R822; CLASS: DISCRETE; FPLIST: RC0201,0201_CC; CAD_APPROVED: Yes; Temp_Range: -55¡ãC ~ 125¡ãC; MFG_PN01: RC-01W473JT; MFG_NAME01: FENGHUA; VOLTAGE: 25V; Value: 47K; PCB Footprint: R0201; HEIGHT: 0.26MM; ROHS: Yes; Temp Range: -55¡ãC ~ 125¡ãC
U501 = SDINBDA6_32G_I_VFBGA_153P: FEMDRM032G-A3A55,153FBGA,eMMC5.1,32GB,-25~85+C; Part Reference: U501; CLASS: IC; CAD_APPROVED: Yes; Temp Range: -25¡ãC to 85¡ãC; MFG_NAME01: FORESEE; Value: FEMDRM032G-A3A55; HEIGHT: 1MM; ROHS: Yes; MFG_PN01: FEMDRM032G-A3A55; PCB Footprint: fbga153_0p5_11p5x13

## Sheet E-09 BOOT_CFG.SchDoc: FRDM-IMX93
size 513 x 386 mm; DrawnBy: FORLINX; Organization: ORGANIZATION; Address1: ADDRESS 1; Address2: ADDRESS 2; Address3: ADDRESS 3; Address4: ADDRESS 4; Revision: -; ENG_APP_DATE: --/--/--; DSN_APP_DATE: --/--/--; CHK_APP_DATE: --/--/--; Classification: Public, Company Internal/Proprietary, Company Confidential,  Company Secret; Page Create Date: March  8, 1995; OrgName: NXP Semiconductor; FIUO: A; OrgAddr1: NO. 192 Liangjing Rd. Pudong New Area, ShangHai; Page Number: 9; PageTitle: BOOT CFG; Page Size: C; Page Count: 23; Designer: FORLINX; RevCode: B1; Approver: NXP SE; Doc: SCH-94611 PDF: SPF-94611; DsnPath: T:\FILES\Designs\Single Board Computers\i.MX93-FRDM\Design Files\SCH-94611_B1.DSN; SchematicName: FRDM-i.MX 93 Development Board; PageName: E-09 BOOT_CFG; PageSize: C; TopSchematic: True
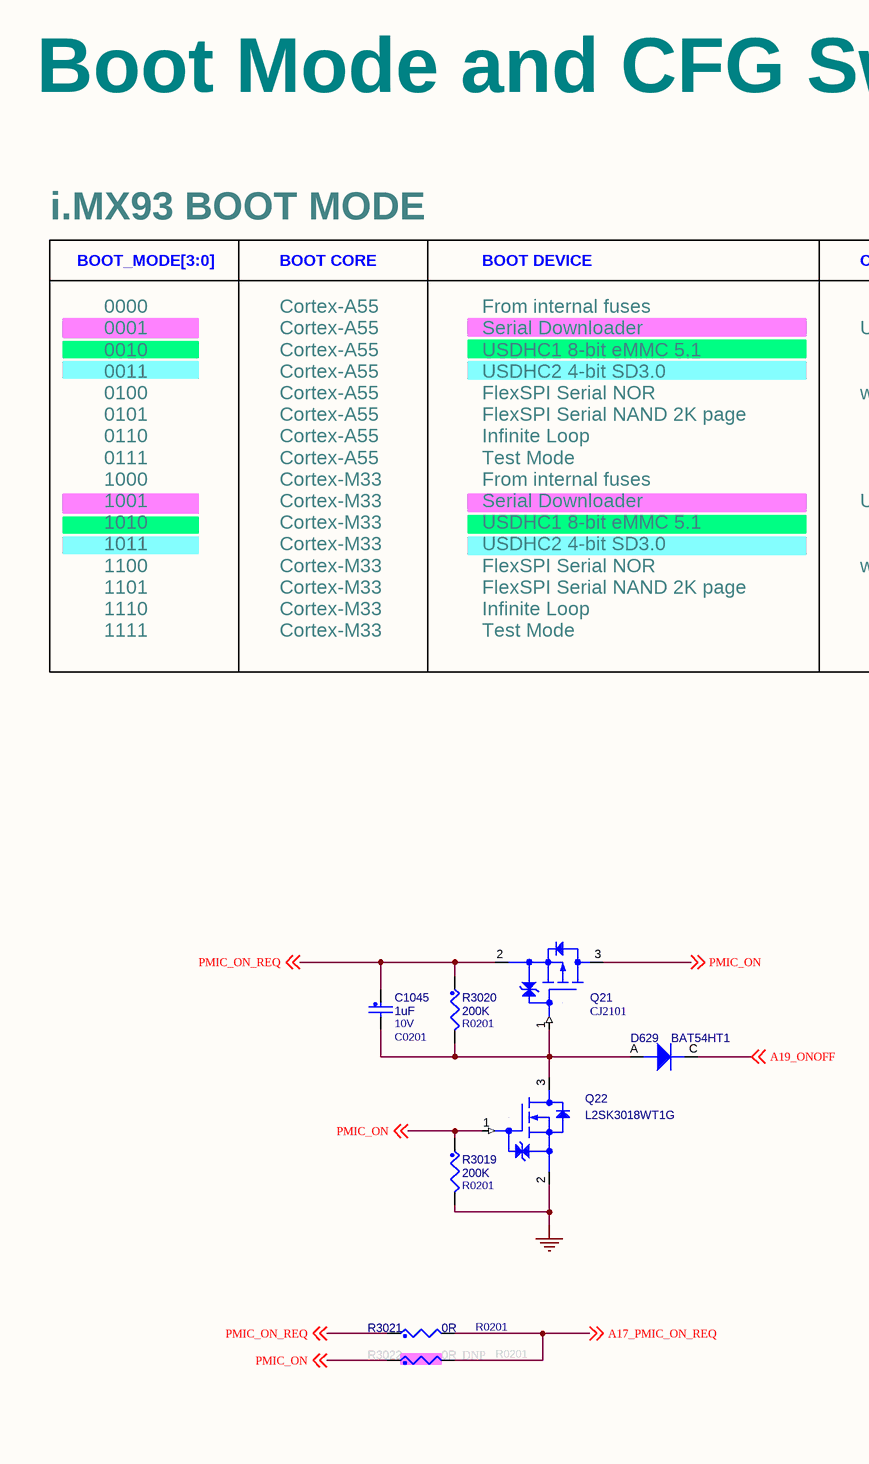
[diagram p16: E-09 BOOT_CFG.SchDoc, left]
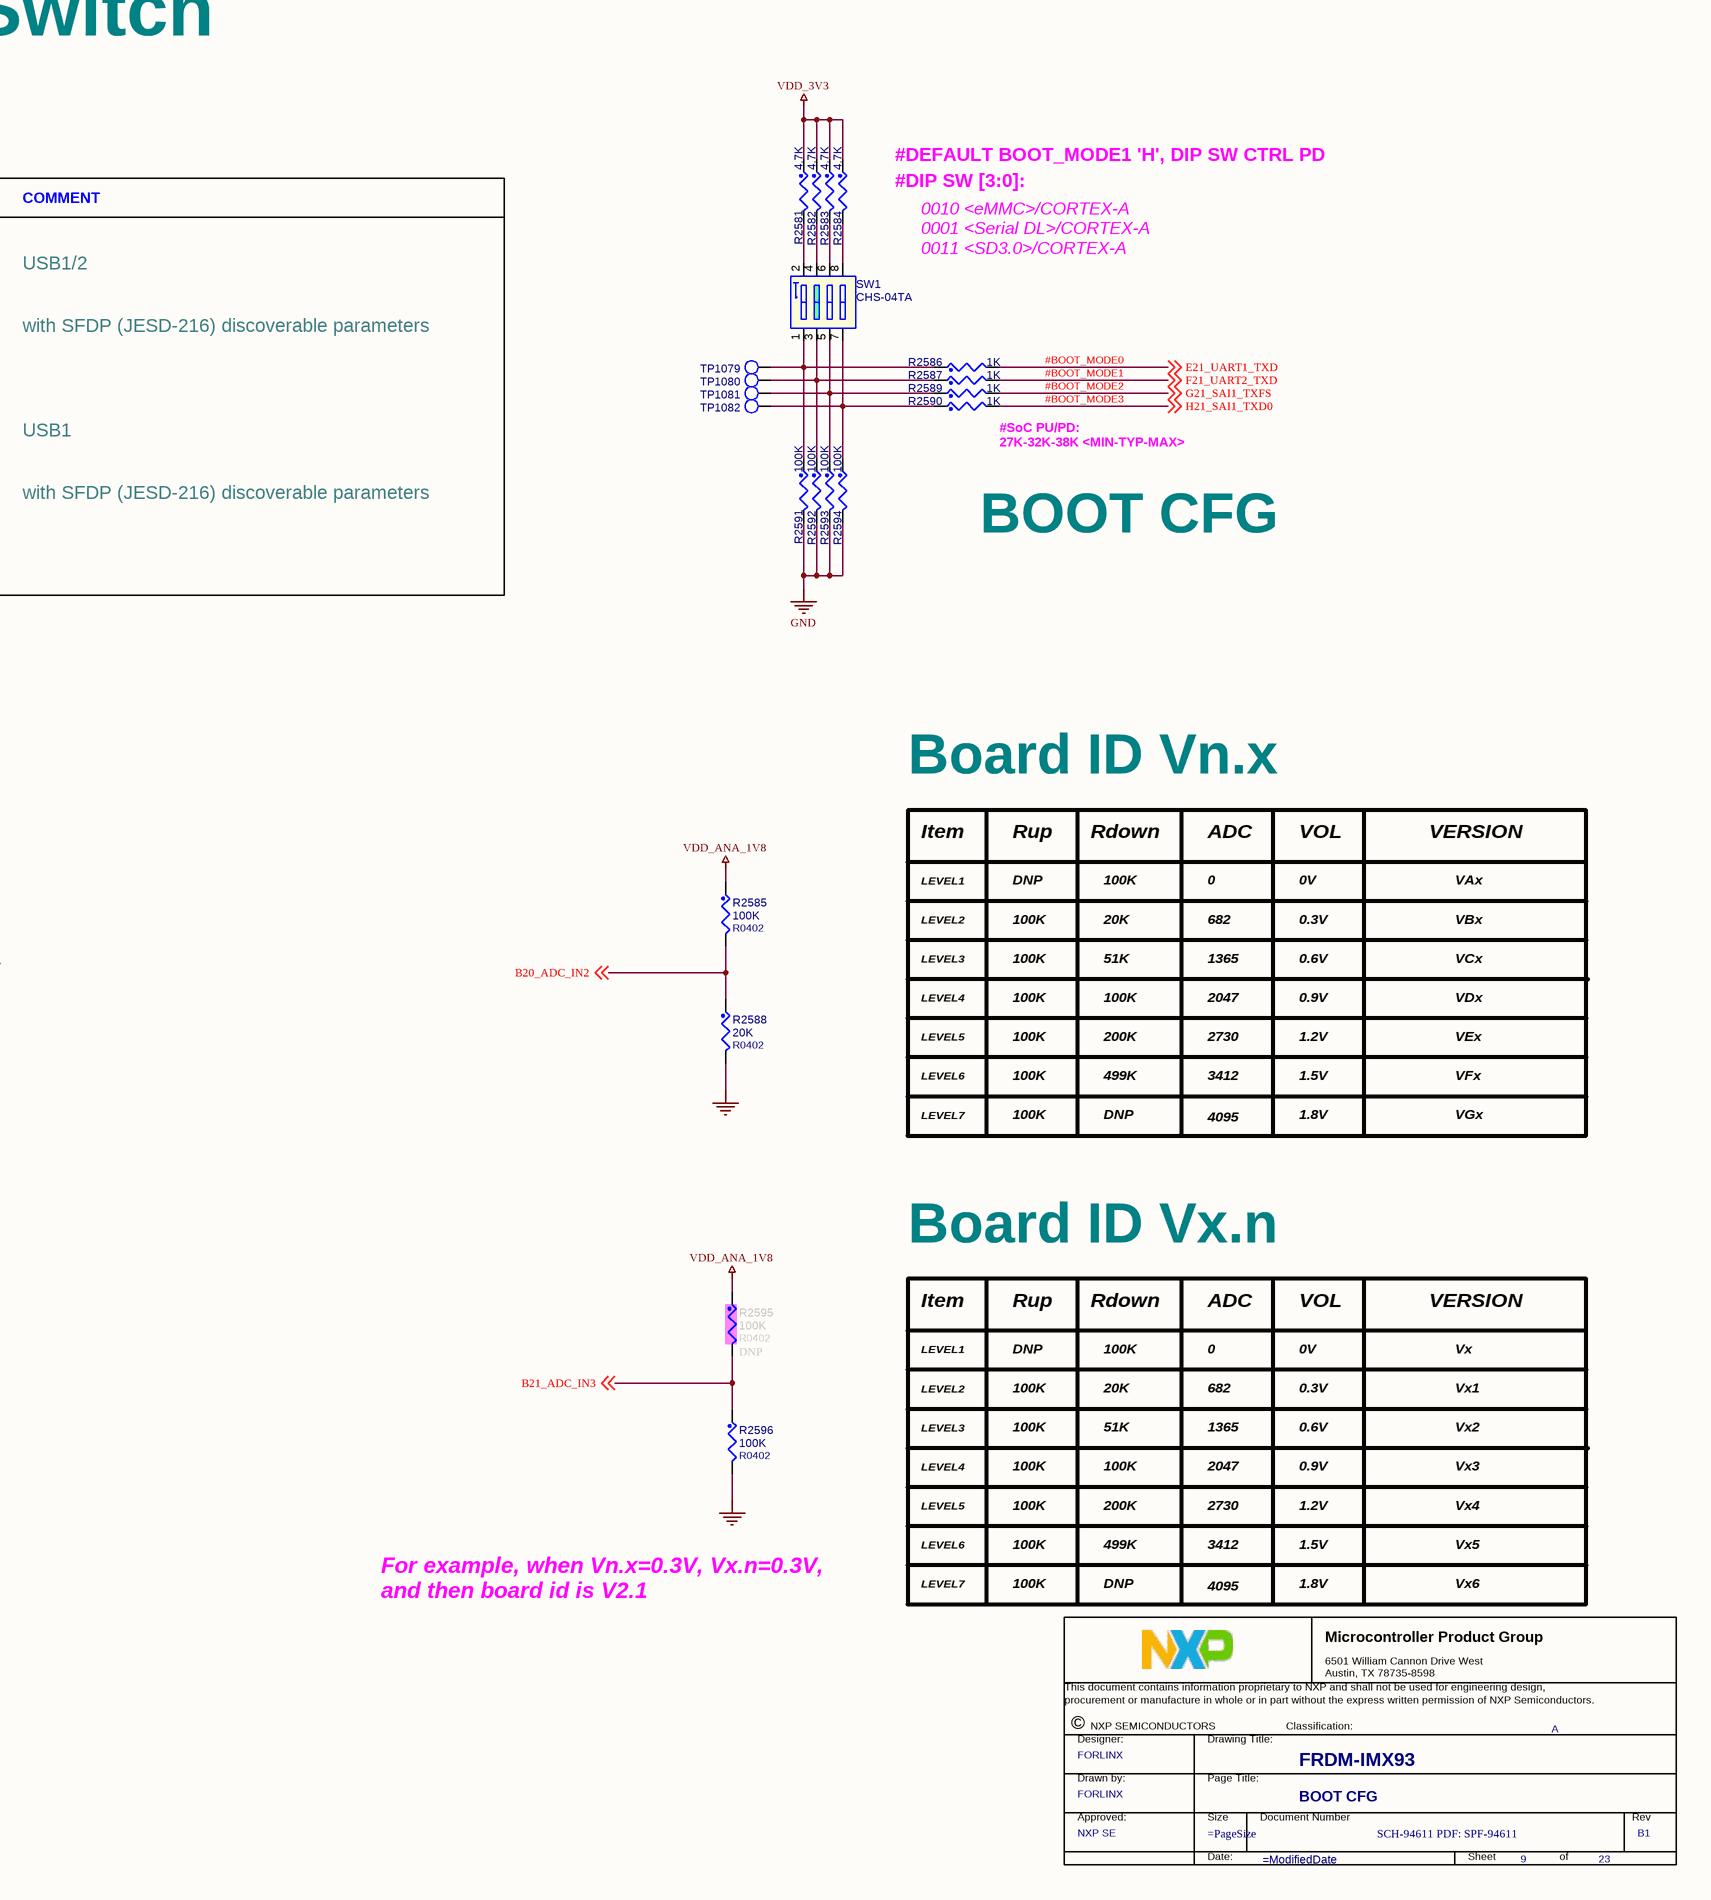
[diagram p17: E-09 BOOT_CFG.SchDoc, right]

### Parts
(Parts that share a designator on the sheet are numbered #1, #2 ... from top to bottom, then left to right.)
*#9  Title: FRDM-IMX93  RevCode: B1  PageTitle: BOOT CFG  Page Number: 9  Page Count: 23  DrawnBy: FORLINX  Doc: SCH-94611 PDF: SPF-94611  Approver: NXP SE  FIUO: A  (graphical)
C1045  1uF  VOLTAGE: 10V  [C0201]
D629  BAT54HT1  [SOD323]
Q21  CJ2101  [sc70_3]
Q22  L2SK3018WT1G  [sc70_3]
R2581  4.7K  [R0201]
R2582  4.7K  [R0201]
R2583  4.7K  [R0201]
R2584  4.7K  [R0201]
R2585  100K  [R0402]
R2586  1K  [R0201]
R2587  1K  [R0201]
R2588  20K  [R0402]
R2589  1K  [R0201]
R2590  1K  [R0201]
R2591  100K  [R0201]
R2592  100K  [R0201]
R2593  100K  [R0201]
R2594  100K  [R0201]
R2595  100K  ASSY_OPT: DNP  [R0402]
R2596  100K  [R0402]
R3019  200K  [R0201]
R3020  200K  [R0201]
R3021  0R  [R0201]
R3022  0R  ASSY_OPT: DNP  [R0201]
SW1  CHS-04TA  [sw_chs_04_a]
TP1079  TPAD_020  [tpad_020]  (value not drawn)
TP1080  TPAD_020  [tpad_020]  (value not drawn)
TP1081  TPAD_020  [tpad_020]  (value not drawn)
TP1082  TPAD_020  [tpad_020]  (value not drawn)

### Nets
GND: Q22.2(SOURCE) R2588.2 R2591.2 R2592.2 R2593.2 R2594.2 R2596.2 R3019.2
VDD_3V3: R2581.1 R2582.1 R2583.1 R2584.1
VDD_ANA_1V8: R2585.1 R2595.1
#BOOT_MODE0: R2586.2 ; off-sheet E21_UART1_TXD  [also labelled E21_UART1_TXD]
#BOOT_MODE1: R2587.2 ; off-sheet F21_UART2_TXD  [also labelled F21_UART2_TXD]
#BOOT_MODE2: R2589.2 ; off-sheet G21_SAI1_TXFS  [also labelled G21_SAI1_TXFS]
#BOOT_MODE3: R2590.2 ; off-sheet H21_SAI1_TXD0  [also labelled H21_SAI1_TXD0]
A17_PMIC_ON_REQ: R3021.2 R3022.2 ; off-sheet A17_PMIC_ON_REQ
A19_ONOFF: D629.C(CATHODE) ; off-sheet A19_ONOFF  [project net ONOFF]
B20_ADC_IN2: R2585.2 R2588.1 ; off-sheet B20_ADC_IN2  [project net ADC_IN2]
B21_ADC_IN3: R2595.2 R2596.1 ; off-sheet B21_ADC_IN3  [project net ADC_IN3]
PMIC_ON: Q21.3(DRAIN) Q22.1(GATE) R3019.1 R3022.1 ; off-sheet PMIC_ON
PMIC_ON_REQ: C1045.1 Q21.2(SOURCE) R3020.1 R3021.1 ; off-sheet PMIC_ON_REQ
NetC1045_2: C1045.2 D629.A(ANODE) Q21.1(GATE) Q22.3(DRAIN) R3020.2
NetR2581_2: R2581.2 SW1.2
NetR2582_2: R2582.2 SW1.4
NetR2583_2: R2583.2 SW1.6
NetR2584_2: R2584.2 SW1.8
NetR2586_1: R2586.1 R2591.1 SW1.1 TP1079.1(TP)
NetR2587_1: R2587.1 R2592.1 SW1.3 TP1080.1(TP)
NetR2589_1: R2589.1 R2593.1 SW1.5 TP1081.1(TP)
NetR2590_1: R2590.1 R2594.1 SW1.7 TP1082.1(TP)

### Notes on the sheet
- Boot Mode and CFG Switch
- i.MX93 BOOT MODE
- BOOT_MODE[3:0]
- BOOT CORE
- BOOT DEVICE
- COMMENT
- #DEFAULT BOOT_MODE1 'H', DIP SW CTRL PD
- #DIP SW [3:0]:
- 0010 <eMMC>/CORTEX-A
  0001 <Serial DL>/CORTEX-A
  0011 <SD3.0>/CORTEX-A
- #SoC PU/PD:
  27K-32K-38K <MIN-TYP-MAX>
- 0000
  0001
  0010
  0011
  0100
  0101
  0110
  0111
  1000
  1001
  1010
  1011
  1100
  1101
  1110
  1111
- Cortex-A55
  Cortex-A55
  Cortex-A55
  Cortex-A55
  Cortex-A55
  Cortex-A55
  Cortex-A55
  Cortex-A55
  Cortex-M33
  Cortex-M33
  Cortex-M33
  Cortex-M33
  Cortex-M33
  Cortex-M33
  Cortex-M33
  Cortex-M33
- From internal fuses
  Serial Downloader
  USDHC1 8-bit eMMC 5.1
  USDHC2 4-bit SD3.0
  FlexSPI Serial NOR
  FlexSPI Serial NAND 2K page
  Infinite Loop
  Test Mode
  From internal fuses
  Serial Downloader
  USDHC1 8-bit eMMC 5.1
  USDHC2 4-bit SD3.0
  FlexSPI Serial NOR
  FlexSPI Serial NAND 2K page
  Infinite Loop
  Test Mode
- USB1/2
  with SFDP (JESD-216) discoverable parameters
  USB1
  with SFDP (JESD-216) discoverable parameters
- BOOT CFG
- Board ID Vn.x
- Item
- Rup
- Rdown
- ADC
- VOL
- VERSION
- LEVEL2
- LEVEL1
- 100K
- DNP
- 20K
- 0
- 682
- 0V
- 0.3V
- VAx
- VBx
- LEVEL3
- 51K
- 1365
- 0.6V
- VCx
- LEVEL5
- LEVEL4
- 200K
- 2047
- 2730
- 0.9V
- 1.2V
- VEx
- VDx
- LEVEL7
- LEVEL6
- 499K
- 3412
- 4095
- 1.8V
- 1.5V
- VFx
- VGx
- Board ID Vx.n
- Vx
- Vx2
- Vx1
- Vx4
- Vx3
- Vx5
- For example, when Vn.x=0.3V, Vx.n=0.3V,
  and then board id is V2.1
- (near *#9) 100K
- (near *#9) DNP
- Vx6
- DWG. NO.
- REV.
- SHT.
- REVISION
- DESCRIPTION
- DATE
- APPROVED
- ENG:
- APPROVALS
- quilter.ai <http://quilter.ai>
- DSN:
- CHK:
- REFERENCE DOCUMENTS
- TITLE
- PROJECT
- BOM:
- FAB DWG:
- PCB DWG:
- ASSY DWG:
- SIZE
- FILE NAME
- C
- DWG NO.
- SHEET
- OF
- REV
- (in symbol TitleBlock_MCPG) Microcontroller Product Group; 6501 William Cannon Drive West / Austin, TX 78735-8598; This document contains information proprietary to NXP and shall not be used for engineering design,; procurement or manufacture in whole or in part without the express written permission of NXP Semiconductors.; ©; NXP SEMICONDUCTORS; Classification:; Designer:; Drawing Title:; Drawn by:; Page Title:; Approved:; Size; Document Number; Rev; Date:; Sheet; of

### Library data of the parts
*#9 = TitleBlock_MCPG: as *#7 on sheet E-07 CPU MISC; Page Size: =PageSize; Page Create Date: March  8, 1995; Designer: FORLINX; Page Modify Date: =ModifiedDate
C1045 = CAP_NP: 0201,1uF,10V,+/-20%,X5R; Part Reference: C1045; CLASS: DISCRETE; Tolerance: 20%; MFG_NAME01: SAMSUNG; MFG_PN01: CL03A105MP3NSNC; CAD_APPROVED: Yes; FPLIST: CC0201,CC0201_HD,0201_CC,0201_CC_012SM_NSP; Value: 1uF; PCB Footprint: C0201; ROHS: Yes; HEIGHT: 0.35MM; Package Size: 0201; Package Type: 7¡± reel
D629 = DIODE: BAT54HT1G,SOD323; Part Reference: D629; CLASS: IC; MFG_NAME01: JSCJ; CAD_APPROVED: Yes; Value: BAT54HT1; PCB Footprint: SOD323; MFG_PN01: BAT54HT1G; HEIGHT: 1.15MM
Q21 = CJ2101: CJ2101,SOT-323,PMOS; Part Reference: Q21; MFG_NAME01: JSCJ; Value: CJ2101; PCB Footprint: sc70_3; MFG_PN01: CJ2101
Q22 = NX3008NBKW_SOT323: Part Reference: Q22; CLASS: IC; MFG_NAME01: LRC; CAD_APPROVED: Yes; Value: L2SK3018WT1G; PCB Footprint: sc70_3; MFG_PN01: L2SK3018WT1G; ROHS: Yes; HEIGHT: 1.1MM
R2581 = RES: 0201,4.7K,+/-1%; Part Reference: R2581; CLASS: DISCRETE; FPLIST: RC0402_25,RC0402_HD,0402_CC,RC0402_X2; Tolerance: 5%; CAD_APPROVED: Yes; MFG_NAME01: FENGHUA; MFG_PN01: RC-01W4701FT; Value: 4.7K; PCB Footprint: R0201; HEIGHT: 0.41mm; ROHS: Yes
R2582 = RES: 0201,4.7K,+/-1%; Part Reference: R2582; CLASS: DISCRETE; MFG_PN01: RC-01W4701FT; MFG_NAME01: FENGHUA; CAD_APPROVED: Yes; Tolerance: 5%; FPLIST: RC0402_25,RC0402_HD,0402_CC,RC0402_X2; Value: 4.7K; PCB Footprint: R0201; ROHS: Yes; HEIGHT: 0.41mm
R2583 = RES: 0201,4.7K,+/-1%; Part Reference: R2583; CLASS: DISCRETE; FPLIST: RC0402_25,RC0402_HD,0402_CC,RC0402_X2; Tolerance: 5%; CAD_APPROVED: Yes; MFG_NAME01: FENGHUA; MFG_PN01: RC-01W4701FT; Value: 4.7K; PCB Footprint: R0201; HEIGHT: 0.41mm; ROHS: Yes
R2584 = RES: 0201,4.7K,+/-1%; Part Reference: R2584; CLASS: DISCRETE; FPLIST: RC0402_25,RC0402_HD,0402_CC,RC0402_X2; Tolerance: 5%; CAD_APPROVED: Yes; MFG_NAME01: FENGHUA; MFG_PN01: RC-01W4701FT; Value: 4.7K; PCB Footprint: R0201; HEIGHT: 0.41mm; ROHS: Yes
R2585 = RES: 0402,100K,+/-1%; Part Reference: R2585; CLASS: DISCRETE; FPLIST: RC0402_25,RC0402_HD,RC0402_X2,0402_CC,CAPC0402_L; CAD_APPROVED: Yes; MFG_PN01: RC-02K1003FT; MFG_NAME01: FENGHUA; Tolerance: 5%; RATING: 1/16W; Value: 100K; PCB Footprint: R0402; HEIGHT: 0.41mm; ROHS: Yes
R2586 = RES: 0201,1K,+/-1%; Part Reference: R2586; CLASS: DISCRETE; FPLIST: RC0402_25,RC0402_HD,RC0402_X2,0402_CC,CAPC0402_L; CAD_APPROVED: Yes; MFG_PN01: RC-01W1001FT; MFG_NAME01: FENGHUA; Tolerance: 5%; RATING: 1/16W; Value: 1K; PCB Footprint: R0201; HEIGHT: 0.41mm; ROHS: Yes
R2587 = RES: 0201,1K,+/-1%; Part Reference: R2587; CLASS: DISCRETE; FPLIST: RC0402_25,RC0402_HD,RC0402_X2,0402_CC,CAPC0402_L; CAD_APPROVED: Yes; MFG_PN01: RC-01W1001FT; MFG_NAME01: FENGHUA; Tolerance: 5%; RATING: 1/16W; Value: 1K; PCB Footprint: R0201; HEIGHT: 0.41mm; ROHS: Yes
R2588 = RES: 0402,20K,+/-1%; Part Reference: R2588; CLASS: DISCRETE; FPLIST: RC0402_25,RC0402_HD,RC0402_X2,0402_CC,CAPC0402_L; CAD_APPROVED: Yes; MFG_PN01: RC-02K2002FT; MFG_NAME01: FENGHUA; Tolerance: 5%; RATING: 1/16W; Value: 20K; PCB Footprint: R0402; HEIGHT: 0.41mm; ROHS: Yes
R2589 = RES: 0201,1K,+/-1%; Part Reference: R2589; CLASS: DISCRETE; FPLIST: RC0402_25,RC0402_HD,RC0402_X2,0402_CC,CAPC0402_L; CAD_APPROVED: Yes; MFG_PN01: RC-01W1001FT; MFG_NAME01: FENGHUA; Tolerance: 5%; RATING: 1/16W; Value: 1K; PCB Footprint: R0201; HEIGHT: 0.41mm; ROHS: Yes
R2590 = RES: 0201,1K,+/-1%; Part Reference: R2590; CLASS: DISCRETE; FPLIST: RC0402_25,RC0402_HD,RC0402_X2,0402_CC,CAPC0402_L; CAD_APPROVED: Yes; MFG_PN01: RC-01W1001FT; MFG_NAME01: FENGHUA; Tolerance: 5%; RATING: 1/16W; Value: 1K; PCB Footprint: R0201; HEIGHT: 0.41mm; ROHS: Yes
R2591 = RES: 0201,100K,+/-1%; Part Reference: R2591; CLASS: DISCRETE; RATING: 1/16W; Tolerance: 5%; MFG_NAME01: FENGHUA; MFG_PN01: RC-01W1003FT; CAD_APPROVED: Yes; FPLIST: RC0402_25,RC0402_HD,RC0402_X2,0402_CC,CAPC0402_L; Value: 100K; PCB Footprint: R0201; ROHS: Yes; HEIGHT: 0.41mm
R2592 = RES: 0201,100K,+/-1%; Part Reference: R2592; CLASS: DISCRETE; VOLTAGE: 50V; Tolerance: 5%; MFG_PN01: RC-01W1003FT; MFG_NAME01: FENGHUA; Temp Range: -55C to +155C; CAD_APPROVED: Yes; FPLIST: RC0402_25,RC0402_HD,0402_CC; Value: 100K; PCB Footprint: R0201; ROHS: Yes; HEIGHT: 0.40 MM
R2593 = RES: 0201,100K,+/-1%; Part Reference: R2593; CLASS: DISCRETE; FPLIST: RC0402_25,RC0402_HD,0402_CC; CAD_APPROVED: Yes; Temp Range: -55C to +155C; MFG_NAME01: FENGHUA; MFG_PN01: RC-01W1003FT; Tolerance: 5%; VOLTAGE: 50V; Value: 100K; PCB Footprint: R0201; HEIGHT: 0.40 MM; ROHS: Yes
R2594 = RES: 0201,100K,+/-1%; Part Reference: R2594; CLASS: DISCRETE; VOLTAGE: 50V; Tolerance: 5%; FPLIST: RC0402_25,RC0402_HD,0402_CC; CAD_APPROVED: Yes; Temp Range: -55C to +155C; MFG_NAME01: FENGHUA; MFG_PN01: RC-01W1003FT; Value: 100K; PCB Footprint: R0201; HEIGHT: 0.40 MM; ROHS: Yes
R2595 = RES: 0402,100K,+/-1%; Part Reference: R2595; CLASS: DISCRETE; FPLIST: RC0402_25,RC0402_HD,RC0402_X2,0402_CC,CAPC0402_L; CAD_APPROVED: Yes; MFG_PN01: RC-02K1003FT; MFG_NAME01: FENGHUA; Tolerance: 5%; RATING: 1/16W; Value: 100K; PCB Footprint: R0402; HEIGHT: 0.41mm; ROHS: Yes
R2596 = RES: 0402,100K,+/-1%; Part Reference: R2596; CLASS: DISCRETE; FPLIST: RC0402_25,RC0402_HD,RC0402_X2,0402_CC,CAPC0402_L; CAD_APPROVED: Yes; MFG_PN01: RC-02K1003FT; MFG_NAME01: FENGHUA; Tolerance: 5%; RATING: 1/16W; Value: 100K; PCB Footprint: R0402; HEIGHT: 0.41mm; ROHS: Yes
R3019 = RES: 0201,200K,+/-1%; Part Reference: R3019; CLASS: DISCRETE; RATING: 1/16W; Tolerance: 5%; MFG_NAME01: FENGHUA; MFG_PN01: RC-01W2003FT; CAD_APPROVED: Yes; FPLIST: RC0402_25,RC0402_HD,RC0402_X2,0402_CC,CAPC0402_L; Value: 200K; PCB Footprint: R0201; ROHS: Yes; HEIGHT: 0.41mm
R3020 = RES: 0201,200K,+/-1%; Part Reference: R3020; CLASS: DISCRETE; FPLIST: RC0402_25,RC0402_HD,RC0402_X2,0402_CC,CAPC0402_L; CAD_APPROVED: Yes; MFG_PN01: RC-01W2003FT; MFG_NAME01: FENGHUA; Tolerance: 5%; RATING: 1/16W; Value: 200K; PCB Footprint: R0201; HEIGHT: 0.41mm; ROHS: Yes
R3021 = RES: 0201,0Ohm,+/-5%; Part Reference: R3021; CLASS: DISCRETE; RATING: 1/16W; Tolerance: 5%; MFG_NAME01: FENGHUA; MFG_PN01: RC-01000JT; CAD_APPROVED: Yes; FPLIST: RC0402_25,RC0402_HD,RC0402_X2,0402_CC,CAPC0402_L; Value: 0R; PCB Footprint: R0201; ROHS: Yes; HEIGHT: 0.41mm
R3022 = RES: 0201,0Ohm,+/-5%; Part Reference: R3022; CLASS: DISCRETE; FPLIST: RC0402_25,RC0402_HD,RC0402_X2,0402_CC,CAPC0402_L; CAD_APPROVED: Yes; MFG_PN01: RC-01000JT; MFG_NAME01: FENGHUA; Tolerance: 5%; RATING: 1/16W; Value: 0R; PCB Footprint: R0201; HEIGHT: 0.41mm; ROHS: Yes
SW1 = CHS-04TA_SW: 4bit,8P,1.27mm,black; Part Reference: SW1; CLASS: IC; CAD_APPROVED: Yes; MFG_NAME01: CTS; MFG_PN01: 4bit-8P-1.27mm; 3D_Mechanical_Footprint_File: ftp://fcl.am.freescale.net/ALLEGRO/step/sw_chs_04_a.step; Value: CHS-04TA; PCB Footprint: sw_chs_04_a; HEIGHT: 2.5MM; ROHS: Yes
TP1079 = T POINT R: no part to order; Part Reference: TP1079; ASSY_OPT: DNP; CLASS: IC; MFG_PN01: NOT A COMPONENT; CAD_APPROVED: Yes; PCB Footprint: tpad_020; MFG_NAME01: NOT A COMPONENT; ROHS: Yes; HEIGHT: 0.1MM
TP1080 = T POINT R: no part to order; Part Reference: TP1080; ASSY_OPT: DNP; CLASS: IC; CAD_APPROVED: Yes; MFG_NAME01: NOT A COMPONENT; PCB Footprint: tpad_020; HEIGHT: 0.1MM; ROHS: Yes; MFG_PN01: NOT A COMPONENT
TP1081 = T POINT R: no part to order; Part Reference: TP1081; ASSY_OPT: DNP; CLASS: IC; CAD_APPROVED: Yes; MFG_NAME01: NOT A COMPONENT; PCB Footprint: tpad_020; HEIGHT: 0.1MM; ROHS: Yes; MFG_PN01: NOT A COMPONENT
TP1082 = T POINT R: no part to order; Part Reference: TP1082; ASSY_OPT: DNP; CLASS: IC; CAD_APPROVED: Yes; MFG_NAME01: NOT A COMPONENT; PCB Footprint: tpad_020; HEIGHT: 0.1MM; ROHS: Yes; MFG_PN01: NOT A COMPONENT